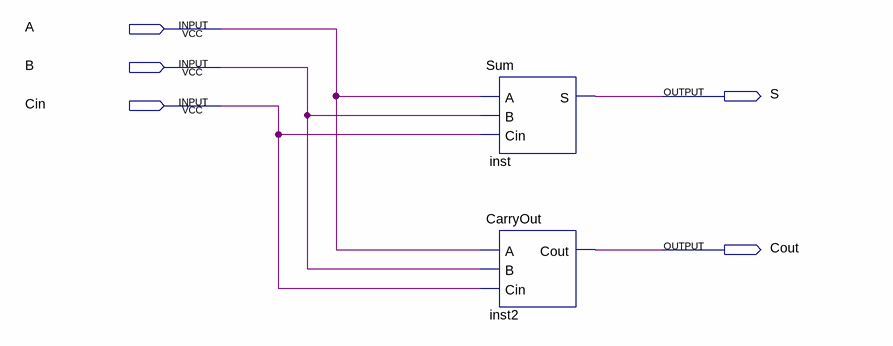
[diagram p0: schematic sheet]
// Quartus schematic FullAdder.bdf as structural Verilog: 2 symbols, 5 pins
module FullAdder (
  input  A,
  input  B,
  input  Cin,
  output S,
  output Cout
);

  Sum inst (.A(A), .B(B), .Cin(Cin), .S(S));
  CarryOut inst2 (.A(A), .B(B), .Cin(Cin), .Cout(Cout));
endmodule
